# Altium schematic sheet 3Phase Inverter2.SchDoc
size A3
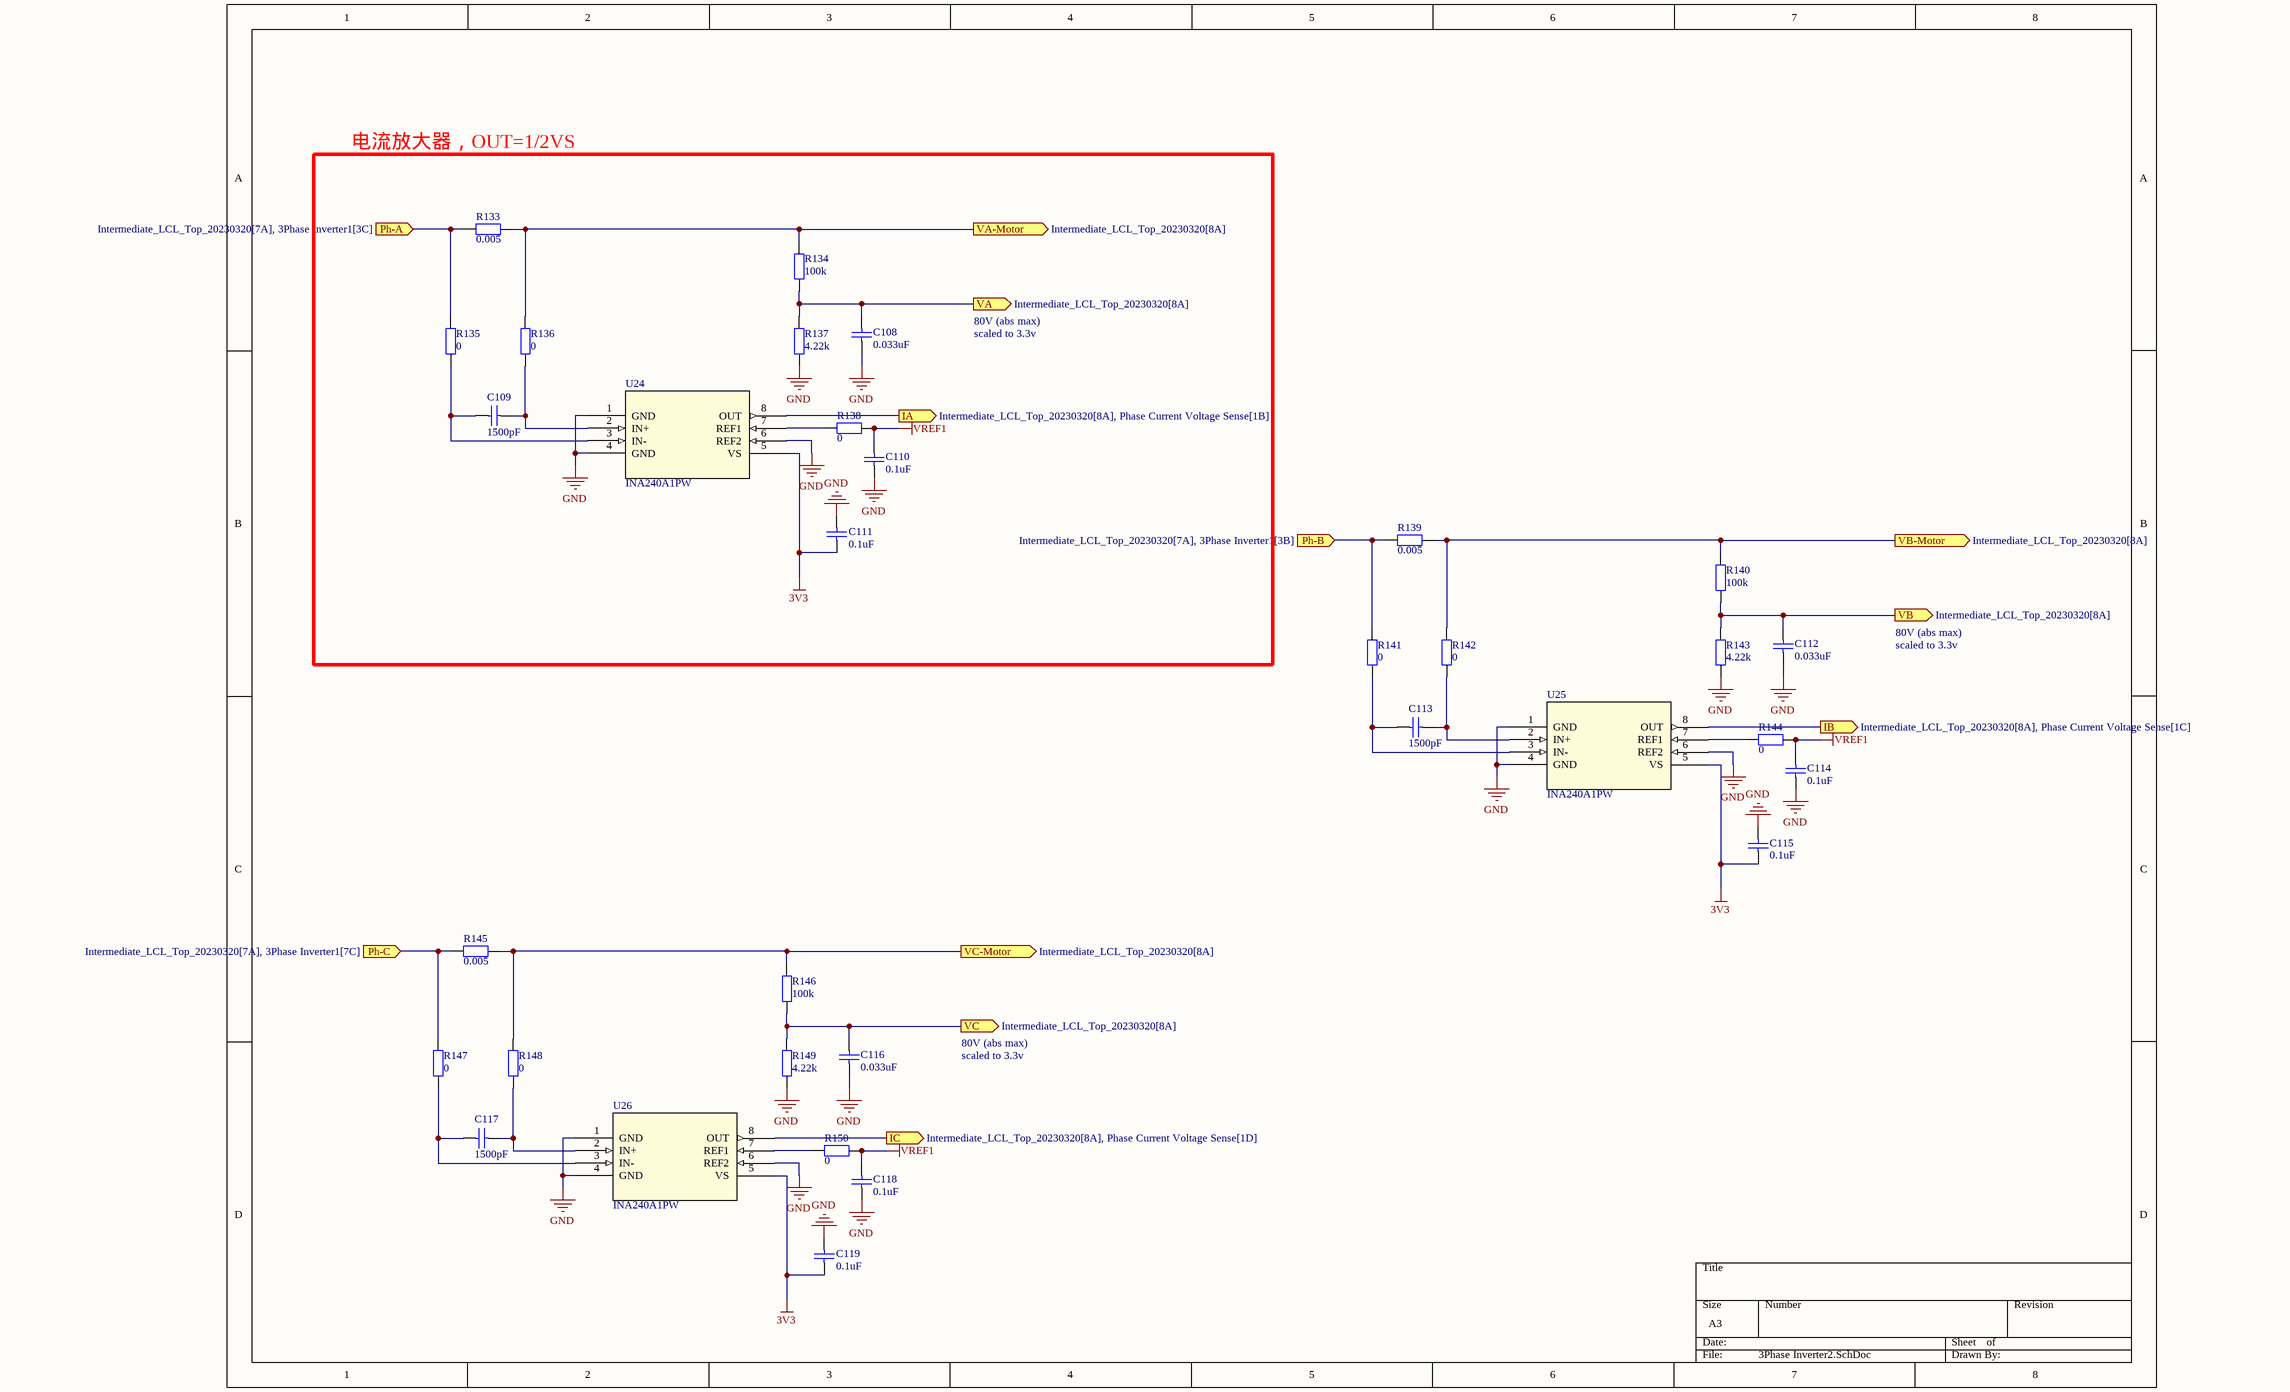
[diagram p0: 3Phase Inverter2.SchDoc]

## Parts
C108  0.033uF  [CAPC1608X06N]
C109  1500pF  [CAPC1608X06N]
C110  0.1uF  [CAPC1608X06N]
C111  0.1uF  [CAPC1608X06N]
C112  0.033uF  [CAPC1608X06N]
C113  1500pF  [CAPC1608X06N]
C114  0.1uF  [CAPC1608X06N]
C115  0.1uF  [CAPC1608X06N]
C116  0.033uF  [CAPC1608X06N]
C117  1500pF  [CAPC1608X06N]
C118  0.1uF  [CAPC1608X06N]
C119  0.1uF  [CAPC1608X06N]
R133  0.005  [RESC1608X05N]
R134  100k  [RESC1608X05N]
R135  0  [RESC1608X05N]
R136  0  [RESC1608X05N]
R137  4.22k  [RESC1608X05N]
R138  0  [RESC1608X05N]
R139  0.005  [RESC1608X05N]
R140  100k  [RESC1608X05N]
R141  0  [RESC1608X05N]
R142  0  [RESC1608X05N]
R143  4.22k  [RESC1608X05N]
R144  0  [RESC1608X05N]
R145  0.005  [RESC1608X05N]
R146  100k  [RESC1608X05N]
R147  0  [RESC1608X05N]
R148  0  [RESC1608X05N]
R149  4.22k  [RESC1608X05N]
R150  0  [RESC1608X05N]
U24  INA240A1PW  [PW0008A_N_TEX]
U25  INA240A1PW  [PW0008A_N_TEX]
U26  INA240A1PW  [PW0008A_N_TEX]

## Ports
IA (out, see Intermediate_LCL_Top_20230320[8A], Phase Current Voltage Sense[1B]), IB (out, see Intermediate_LCL_Top_20230320[8A], Phase Current Voltage Sense[1C]), IC (out, see Intermediate_LCL_Top_20230320[8A], Phase Current Voltage Sense[1D]), Ph-A (in, see Intermediate_LCL_Top_20230320[7A], 3Phase Inverter1[3C]), Ph-B (in, see Intermediate_LCL_Top_20230320[7A], 3Phase Inverter1[3B]), Ph-C (in, see Intermediate_LCL_Top_20230320[7A], 3Phase Inverter1[7C]), VA (out, see Intermediate_LCL_Top_20230320[8A]), VA-Motor (out, see Intermediate_LCL_Top_20230320[8A]), VB (out, see Intermediate_LCL_Top_20230320[8A]), VB-Motor (out, see Intermediate_LCL_Top_20230320[8A]), VC (out, see Intermediate_LCL_Top_20230320[8A]), VC-Motor (out, see Intermediate_LCL_Top_20230320[8A])

## Nets
3V3: C111.2 C115.2 C119.2 U24.5(VS) U25.5(VS) U26.5(VS)
GND: C108.2 C110.2 C111.1 C112.2 C114.2 C115.1 C116.2 C118.2 C119.1 R137.1 R143.1 R149.1 U24.1(GND) U24.4(GND) U24.6(REF2) U25.1(GND) U25.4(GND) U25.6(REF2) U26.1(GND) U26.4(GND) U26.6(REF2)
VREF1: C110.1 C114.1 C118.1 R138.1 R144.1 R150.1
IA: U24.8(OUT) ; port IA
IB: U25.8(OUT) ; port IB
IC: U26.8(OUT) ; port IC
Ph-A: R133.2 R135.1 ; port Ph-A
Ph-B: R139.2 R141.1 ; port Ph-B
Ph-C: R145.2 R147.1 ; port Ph-C
VA: C108.1 R134.1 R137.2 ; port VA
VA-Motor: R133.1 R134.2 R136.1 ; port VA-Motor
VB: C112.1 R140.1 R143.2 ; port VB
VB-Motor: R139.1 R140.2 R142.1 ; port VB-Motor
VC: C116.1 R146.1 R149.2 ; port VC
VC-Motor: R145.1 R146.2 R148.1 ; port VC-Motor
NetC109_1: C109.1 R136.2 U24.2(IN+)
NetC109_2: C109.2 R135.2 U24.3(IN-)
NetC113_1: C113.1 R142.2 U25.2(IN+)
NetC113_2: C113.2 R141.2 U25.3(IN-)
NetC117_1: C117.1 R148.2 U26.2(IN+)
NetC117_2: C117.2 R147.2 U26.3(IN-)
NetR138_2: R138.2 U24.7(REF1)
NetR144_2: R144.2 U25.7(REF1)
NetR150_2: R150.2 U26.7(REF1)

## Notes on the sheet
- 电流放大器，OUT=1/2VS
- 80V (abs max)
- scaled to 3.3v

## Library data of the parts
C108-C119 = Cap: Capacitor; Published: 8-Jun-2000; LatestRevisionDate: 17-Jul-2002; LatestRevisionNote: Re-released for DXP Platform.; PackageReference: RAD-0.3; Publisher: Altium Limited; PackageDescription: Radial Cap, Thru-Hole; 2 Leads; 0.3 in Pin Spacing
  C108 C112 C116: Value: 0.033uF
  C109 C113 C117: Value: 1500pF
  C110 C111 C114 C115 C118 C119: Value: 0.1uF
R133-R150 = 0603 100KΩ (1003) 1%_4: 贴片电阻; Value: 1MΩ(1%); ComponentLink1Description: 供应商链接; ComponentLink1URL: http://www.szlcsc.com/product/details_26546.html; Package: 0603; Supplier: LC; SuppliersPartNumber: C25803
U24-U26 = INA240A1PW: No Description Available; Mfr_Name: Texas Instruments; Copyright: Copyright (C) 2024 Ultra Librarian. All rights reserved.; Manufacturer_Part_Number: INA240A1PW; RefDes: RefDes; Type: DEV